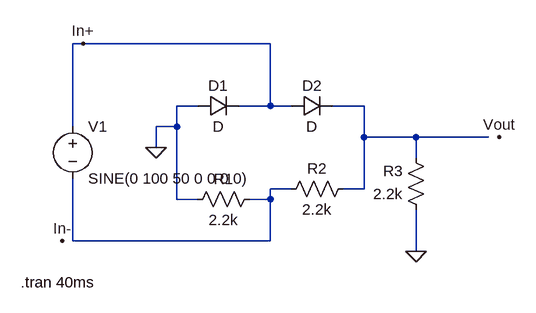
[diagram p0: schematic 1.asc]
1.asc, the LTspice schematic file:
Version 4.1
SHEET 1 880 680
WIRE -64 16 -80 16
WIRE 224 16 -64 16
WIRE 112 112 80 112
WIRE 224 112 224 16
WIRE 224 112 176 112
WIRE 256 112 224 112
WIRE 368 112 320 112
WIRE -80 144 -80 16
WIRE 80 144 80 112
WIRE 80 144 48 144
WIRE 368 160 368 112
WIRE 448 160 368 160
WIRE 560 160 448 160
WIRE 48 176 48 144
WIRE 448 192 448 160
WIRE 256 240 224 240
WIRE 368 240 368 160
WIRE 368 240 336 240
WIRE 80 256 80 144
WIRE 112 256 80 256
WIRE 224 256 224 240
WIRE 224 256 192 256
WIRE -80 320 -80 224
WIRE 224 320 224 256
WIRE 224 320 -80 320
WIRE 448 336 448 272
FLAG 48 176 0
FLAG 448 336 0
FLAG 576 160 Vout
FLAG -64 16 In+
FLAG -96 320 In-
SYMBOL diode 112 128 R270
WINDOW 0 32 32 VTop 2
WINDOW 3 0 32 VBottom 2
SYMATTR InstName D1
SYMBOL diode 256 128 R270
WINDOW 0 32 32 VTop 2
WINDOW 3 0 32 VBottom 2
SYMATTR InstName D2
SYMBOL voltage -80 128 R0
SYMATTR InstName V1
SYMATTR Value SINE(0 100 50 0 0 0 0)
SYMBOL res 208 240 R90
WINDOW 0 0 56 VBottom 2
WINDOW 3 32 56 VTop 2
SYMATTR InstName R1
SYMATTR Value 2.2k
SYMBOL res 352 224 R90
WINDOW 0 0 56 VBottom 2
WINDOW 3 32 56 VTop 2
SYMATTR InstName R2
SYMATTR Value 2.2k
SYMBOL res 464 288 R180
WINDOW 0 36 76 Left 2
WINDOW 3 36 40 Left 2
SYMATTR InstName R3
SYMATTR Value 2.2k
TEXT -160 384 Left 2 !.tran 40ms

The netlist it stands for:
* 1.asc
D1 0 In+ D
D2 In+ N001 D
V1 In+ N002 SINE(0 100 50 0 0 0 0)
R1 N002 0 2.2k
R2 N001 N002 2.2k
R3 0 N001 2.2k
.model D D
.lib standard.dio
.tran 40ms
.backanno
.end